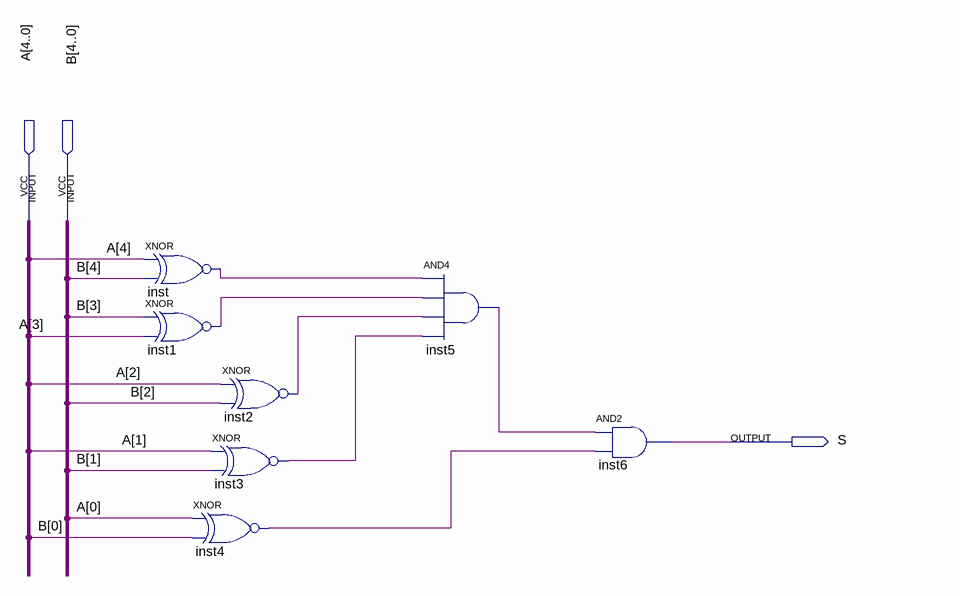
[diagram p0: schematic sheet]
// Quartus schematic comparadores(igual).bdf as structural Verilog: 7 symbols, 3 pins
module \comparadores(igual)  (
  input  [4:0] A,
  input  [4:0] B,
  output S
);

  wire inst1_out, inst2_out, inst3_out, inst4_out, inst5_out, inst_out;

  xnor inst (inst_out, A[4], B[4]);
  xnor inst1 (inst1_out, B[3], A[3]);
  xnor inst2 (inst2_out, A[2], B[2]);
  xnor inst3 (inst3_out, A[1], B[1]);
  xnor inst4 (inst4_out, A[0], B[0]);
  and inst5 (inst5_out, inst_out, inst1_out, inst2_out, inst3_out);
  and inst6 (S, inst5_out, inst4_out);
endmodule
